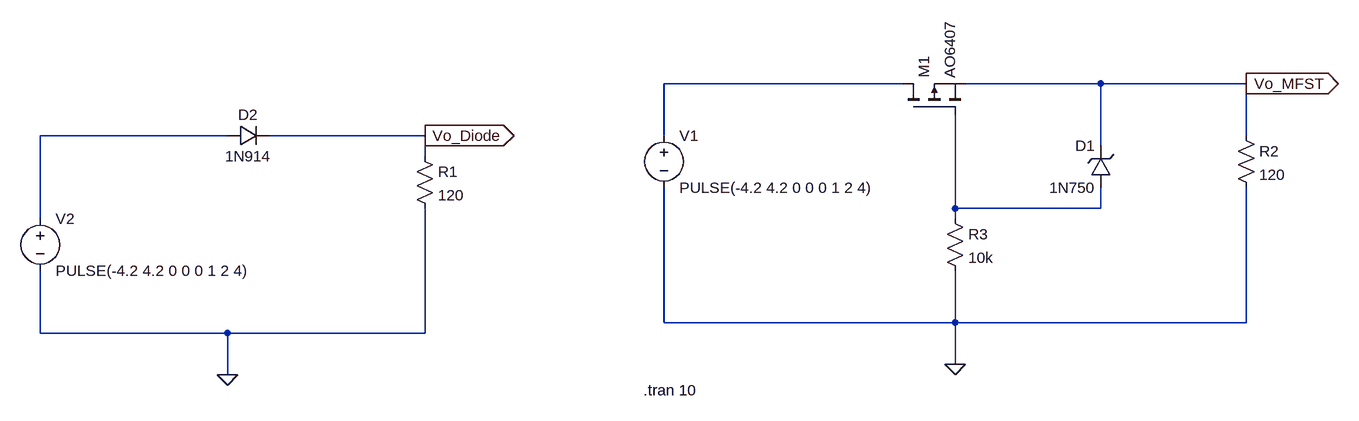
[diagram p0: schematic Reverse polarity.asc]
Reverse polarity.asc, the LTspice schematic file:
Version 4
SHEET 1 1480 680
WIRE 176 80 -192 80
WIRE 480 80 272 80
WIRE 704 80 480 80
WIRE -864 160 -1152 160
WIRE -560 160 -800 160
WIRE -192 160 -192 80
WIRE 704 160 704 80
WIRE 480 176 480 80
WIRE -560 192 -560 160
WIRE 256 272 256 128
WIRE 480 272 480 240
WIRE 480 272 256 272
WIRE -1152 288 -1152 160
WIRE 256 288 256 272
WIRE -192 448 -192 240
WIRE 256 448 256 368
WIRE 256 448 -192 448
WIRE 704 448 704 240
WIRE 704 448 256 448
WIRE -1152 464 -1152 368
WIRE -864 464 -1152 464
WIRE -560 464 -560 272
WIRE -560 464 -864 464
WIRE 256 512 256 448
WIRE -864 528 -864 464
FLAG 256 512 0
FLAG -864 528 0
FLAG 704 80 Vo_MFST
IOPIN 704 80 Out
FLAG -560 160 Vo_Diode
IOPIN -560 160 Out
SYMBOL res 240 272 R0
SYMATTR InstName R3
SYMATTR Value 10k
SYMATTR SpiceLine tol=1 pwr=0.1
SYMBOL pmos 176 128 R270
SYMATTR InstName M1
SYMATTR Value AO6407
SYMBOL res 688 144 R0
SYMATTR InstName R2
SYMATTR Value 120
SYMBOL zener 496 240 R180
WINDOW 0 24 64 Left 2
WINDOW 3 24 0 Left 2
SYMATTR InstName D1
SYMATTR Value 1N750
SYMATTR Description Diode
SYMATTR Type diode
SYMBOL diode -864 176 R270
WINDOW 0 32 32 VTop 2
WINDOW 3 0 32 VBottom 2
SYMATTR InstName D2
SYMATTR Value 1N914
SYMBOL res -576 176 R0
SYMATTR InstName R1
SYMATTR Value 120
SYMBOL voltage -1152 272 R0
WINDOW 123 0 0 Left 0
WINDOW 39 0 0 Left 0
SYMATTR InstName V2
SYMATTR Value PULSE(-4.2 4.2 0 0 0 1 2 4)
SYMBOL voltage -192 144 R0
WINDOW 123 0 0 Left 0
WINDOW 39 0 0 Left 0
SYMATTR InstName V1
SYMATTR Value PULSE(-4.2 4.2 0 0 0 1 2 4)
TEXT -224 552 Left 2 !.tran 10

The netlist it stands for:
* Reverse polarity.asc
R3 N003 0 10k tol=1 pwr=0.1
M1 N001 N003 Vo_MFST Vo_MFST AO6407
R2 Vo_MFST 0 120
D1 N003 Vo_MFST 1N750
D2 N002 Vo_Diode 1N914
R1 Vo_Diode 0 120
V2 N002 0 PULSE(-4.2 4.2 0 0 0 1 2 4)
V1 N001 0 PULSE(-4.2 4.2 0 0 0 1 2 4)
.model D D
.lib standard.dio
.model NMOS NMOS
.model PMOS PMOS
.lib standard.mos
.tran 10
.backanno
.end